# Altium schematic sheet MOTOR V1.1.SchDoc
size A4
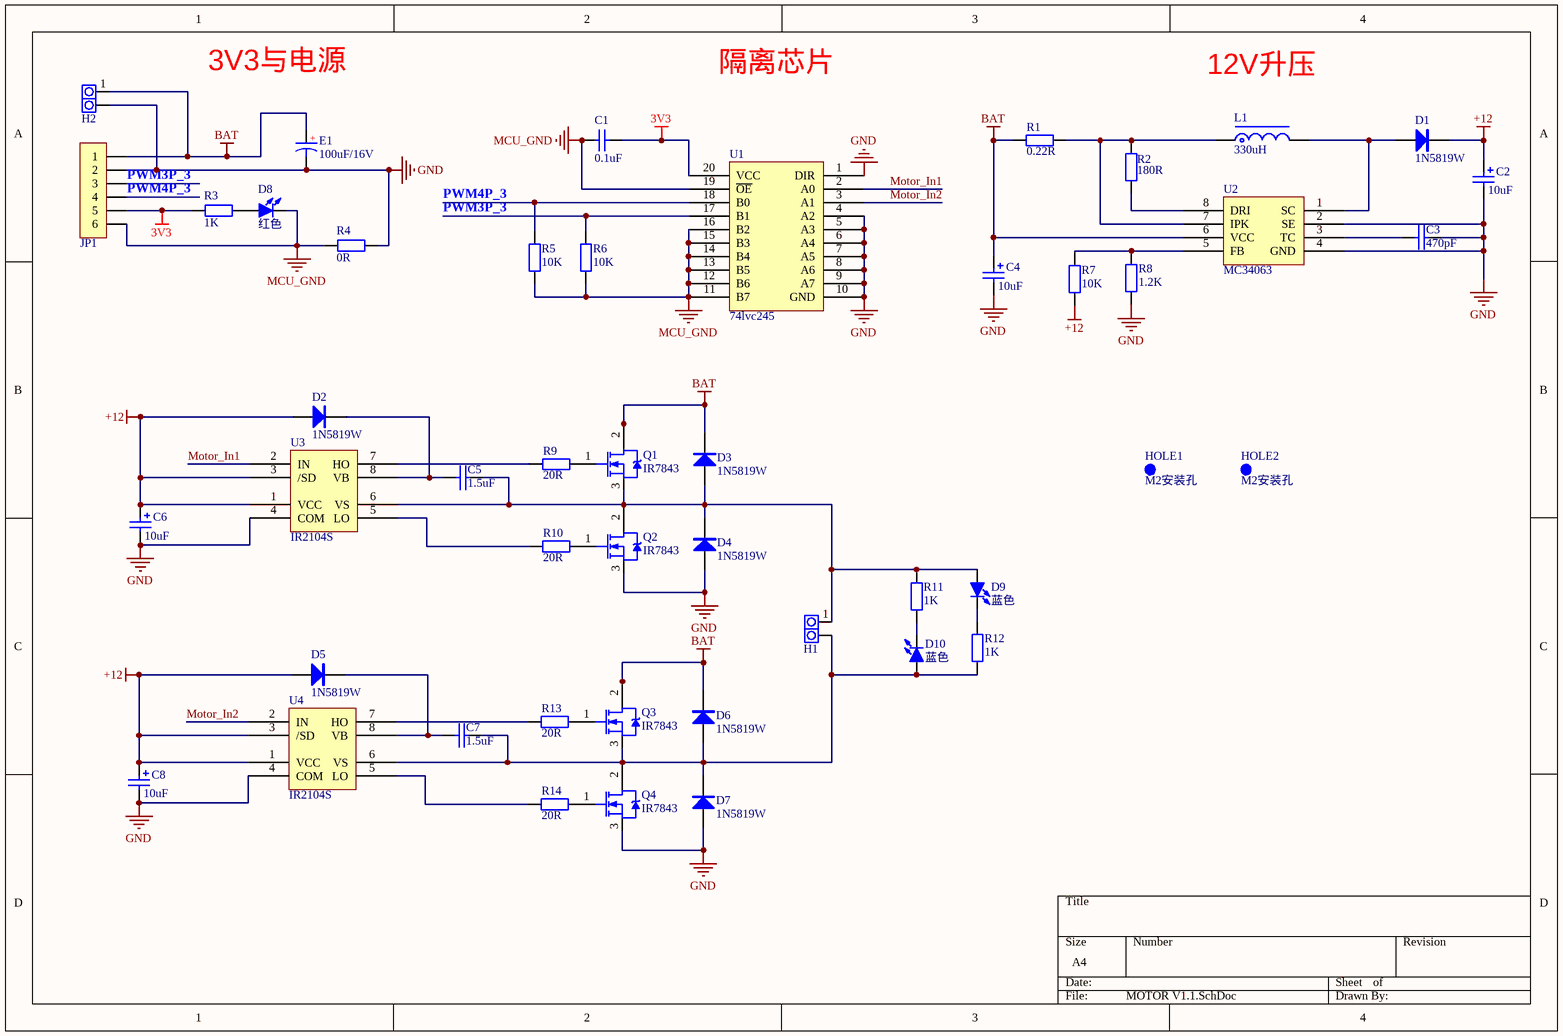
[diagram p0: MOTOR V1.1.SchDoc]

## Parts
C1  0.1uF  [C0603_M]
C2  10uF  [C_3216]
C3  470pF  [R0603_M]
C4  10uF  [C_3216]
C5  1.5uF  [R1206_M]
C6  10uF  [C_3216]
C7  1.5uF  [R1206_M]
C8  10uF  [C_3216]
D1  1N5819W  [SOD-123]
D2  1N5819W  [SOD-123]
D3  1N5819W  [SOD-123]
D4  1N5819W  [SOD-123]
D5  1N5819W  [SOD-123]
D6  1N5819W  [SOD-123]
D7  1N5819W  [SOD-123]
D8  红色  [LED0603_B]
D9  蓝色  [LED0603_B]
D10  蓝色  [LED0603_B]
E1  100uF/16V  [CS 5*6 - B]
H1  PAD2  [PAD2-5.08]  (value not drawn)
H2  PAD2  [PAD2-5.08]  (value not drawn)
HOLE1  M2安装孔  [M2安装孔]
HOLE2  M2安装孔  [M2安装孔]
JP1  HDR-1X6  [XH2.54-WI-6P]  (value not drawn)
L1  330uH  [功率电感]
Q1  IR7843  [TO-252  mos管]
Q2  IR7843  [TO-252  mos管]
Q3  IR7843  [TO-252  mos管]
Q4  IR7843  [TO-252  mos管]
R1  0.22R  [R0603_M]
R2  180R  [R0603_M]
R3  1K  [R0603_M]
R4  0R  [R0603_M]
R5  10K  [R0603_M]
R6  10K  [R0603_M]
R7  10K  [R0603_M]
R8  1.2K  [R0603_M]
R9  20R  [R0603_M]
R10  20R  [R0603_M]
R11  1K  [R0603_M]
R12  1K  [R0603_M]
R13  20R  [R0603_M]
R14  20R  [R0603_M]
U1  74lvc245  [TSSOP20_M]
U2  MC34063  [SO8NB]
U3  IR2104S  [SO8NB]
U4  IR2104S  [SO8NB]

## Nets
3V3: C1.1 JP1.5 R3.2 U1.20(VCC)
+12: C2.1 C6.1 C8.1 D1.2(K) D2.1(A) D5.1(A) R7.1 U3.1(VCC) U3.3(/SD) U4.1(VCC) U4.3(/SD)
BAT: C4.1 D3.2(K) D6.2(K) E1.1 H2.1 JP1.1 Q1.2(D) Q3.2(D) R1.1 U2.6(VCC)
GND: C2.2 C3.2 C4.2 C6.2 C8.2 D4.1(A) D7.1(A) E1.2 H2.2 JP1.2 Q2.3(S) Q4.3(S) R4.2 R8.1 U1.1(DIR) U1.4(A2) U1.5(A3) U1.6(A4) U1.7(A5) U1.8(A6) U1.9(A7) U1.10(GND) U2.2(SE) U2.4(GND) U3.4(COM) U4.4(COM)
MCU_GND: C1.2 D8.2(K) JP1.6 R4.1 R5.1 R6.1 U1.11(B7) U1.12(B6) U1.13(B5) U1.14(B4) U1.15(B3) U1.16(B2) U1.19(~{OE})
Motor_In1: U1.2(A0) U3.2(IN)
Motor_In2: U1.3(A1) U4.2(IN)
PWM3P_3: JP1.3 R6.2 U1.17(B1)
PWM4P_3: JP1.4 R5.2 U1.18(B0)
NetC3_1: C3.1 U2.3(TC)
NetC5_1: C5.1 D2.2(K) U3.8(VB)
NetC5_2: C5.2 D3.1(A) D4.2(K) D9.1(A) H1.1 Q1.3(S) Q2.2(D) R11.2 U3.6(VS)
NetC7_1: C7.1 D5.2(K) U4.8(VB)
NetC7_2: C7.2 D6.1(A) D7.2(K) D10.1(A) H1.2 Q3.3(S) Q4.2(D) R12.2 U4.6(VS)
NetD1_1: D1.1(A) L1.2 U2.1(SC)
NetD8_1: D8.1(A) R3.1
NetD9_2: D9.2(K) R12.1
NetD10_2: D10.2(K) R11.1
NetL1_1: L1.1 R1.2 R2.2 U2.7(IPK)
NetQ1_1: Q1.1(G) R9.2
NetQ2_1: Q2.1(G) R10.2
NetQ3_1: Q3.1(G) R13.2
NetQ4_1: Q4.1(G) R14.2
NetR2_1: R2.1 U2.8(DRI)
NetR7_2: R7.2 R8.2 U2.5(FB)
NetR9_1: R9.1 U3.7(HO)
NetR10_1: R10.1 U3.5(LO)
NetR13_1: R13.1 U4.7(HO)
NetR14_1: R14.1 U4.5(LO)

## Notes on the sheet
- 3V3与电源
- 隔离芯片
- 12V升压
- (in symbol CS_SMD) +

## Library data of the parts
C1 = C: 贴片电容; BOM名称: 无极性贴片电容; 联系卖家，免费查找封装: 唯一出售店铺网址https://shop463601444.taobao.com; 封装库来自淘宝卖家ID：黄晶宝石: 其他店铺购入均为盗版假冒封装库，请立即申请退款
C2 C4 C6 C8 = Cap Pol1: Polarized Capacitor (Radial); Published: 8-Jun-2000; LatestRevisionDate: 17-Jul-2002; LatestRevisionNote: Re-released for DXP Platform.; PackageReference: RB7.6-15; Publisher: Altium Limited; PackageDescription: Polarized Capacitor (Radial); 2 Leads; Value: 10uF
C3 C5 C7 = Cap: Capacitor
D1-D7 = 1N5822: 肖特基二极管; 联系卖家，免费查找封装: 唯一出售店铺网址https://shop463601444.taobao.com; BOM名称: 肖特基二极管
D8-D10 = LED-SMD: 贴片LED; 封装库来自淘宝卖家 ID：黄晶宝石: 其他店铺购入均为假冒，请立即申请退款，本店奖励现金5~20元; BOM名称: 贴片LED
E1 = CS_SMD: 贴片固态电容; 联系卖家，免费查找封装: 唯一出售店铺网址https://shop463601444.taobao.com; 封装库来自淘宝卖家ID：黄晶宝石: 其他店铺购入均为盗版假冒封装库，请立即申请退款; BOM名称: 贴片固态电容
H1 H2 = PAD2: 引线焊盘; 联系卖家，免费查找封装: 唯一出售店铺网址https://shop463601444.taobao.com; BOM名称: 引线焊盘
JP1 = Header 6: 6P接插件; 封装库来自淘宝卖家 ID：黄晶宝石: 其他店铺购入均为盗版假冒封装库; 联系卖家，免费查找封装: 唯一出售店铺网址https://shop463601444.taobao.com; BOM名称: 6P接插件
L1 = L-CDRH: CDRH功率屏蔽电感; BOM名称: 功率屏蔽电感; 联系卖家，免费查找封装: 唯一出售店铺网址https://shop463601444.taobao.com; 封装库来自淘宝卖家ID：黄晶宝石: 其他店铺购入均为盗版假冒封装库，请立即申请退款
Q1-Q4 = NMOS-2: N-Channel Power MOSFET; Note: Pin 2 is electrically connected to pin 4.; Published: 8-Jun-2000; LatestRevisionDate: 17-Jul-2002; LatestRevisionNote: Re-released for DXP Platform.; DatasheetVersion: PD-9.814; PackageVersion: Feb-1997; PackageReference: TO-220AB; Publisher: Altium Limited; PackageDescription: TO, Thru-Hole, Vertical, Heatsink Mounted; 3 In-Line Leads; Pitch 2.54 mm; ComponentLink1Description: Manufacturer Link; ComponentLink1URL: http://www.irf.com/
R1 R2 = Res2: Resistor; Published: 8-Jun-2000; LatestRevisionDate: 17-Jul-2002; LatestRevisionNote: Re-released for DXP Platform.; PackageReference: AXIAL-0.4; Publisher: Altium Limited; PackageDescription: Axial Device, Thru-Hole; 2 Leads; 0.4 in Pin Spacing
  R1: Value: 0.22R
R3-R8 R11 R12 = R: 贴片电阻; 联系卖家，免费查找封装: 唯一出售店铺网址https://shop463601444.taobao.com; 封装库来自淘宝卖家ID：黄晶宝石: 其他店铺购入均为盗版假冒封装库，请立即申请退款; BOM名称: 贴片电阻
R9 R10 R13 R14 = Res2: Resistor; Value: 0.22R; Published: 8-Jun-2000; LatestRevisionDate: 17-Jul-2002; LatestRevisionNote: Re-released for DXP Platform.; PackageReference: AXIAL-0.4; Publisher: Altium Limited; PackageDescription: Axial Device, Thru-Hole; 2 Leads; 0.4 in Pin Spacing
U1 = 74lvc245: 8位5伏转3.3伏电平转换芯片